# EasyEDA Pro project ProDoc_P1_2025-09-22.epro

# Schematic Schematic3
Board Name: 处理器; Create Date: 2024-10-04; Page Name: P1; Project Name: 八通道接口; Schematic Name: Schematic3; Update Date: 2024-10-06; Company: 嘉立创EDA; Page Size: B; Version: V1.0
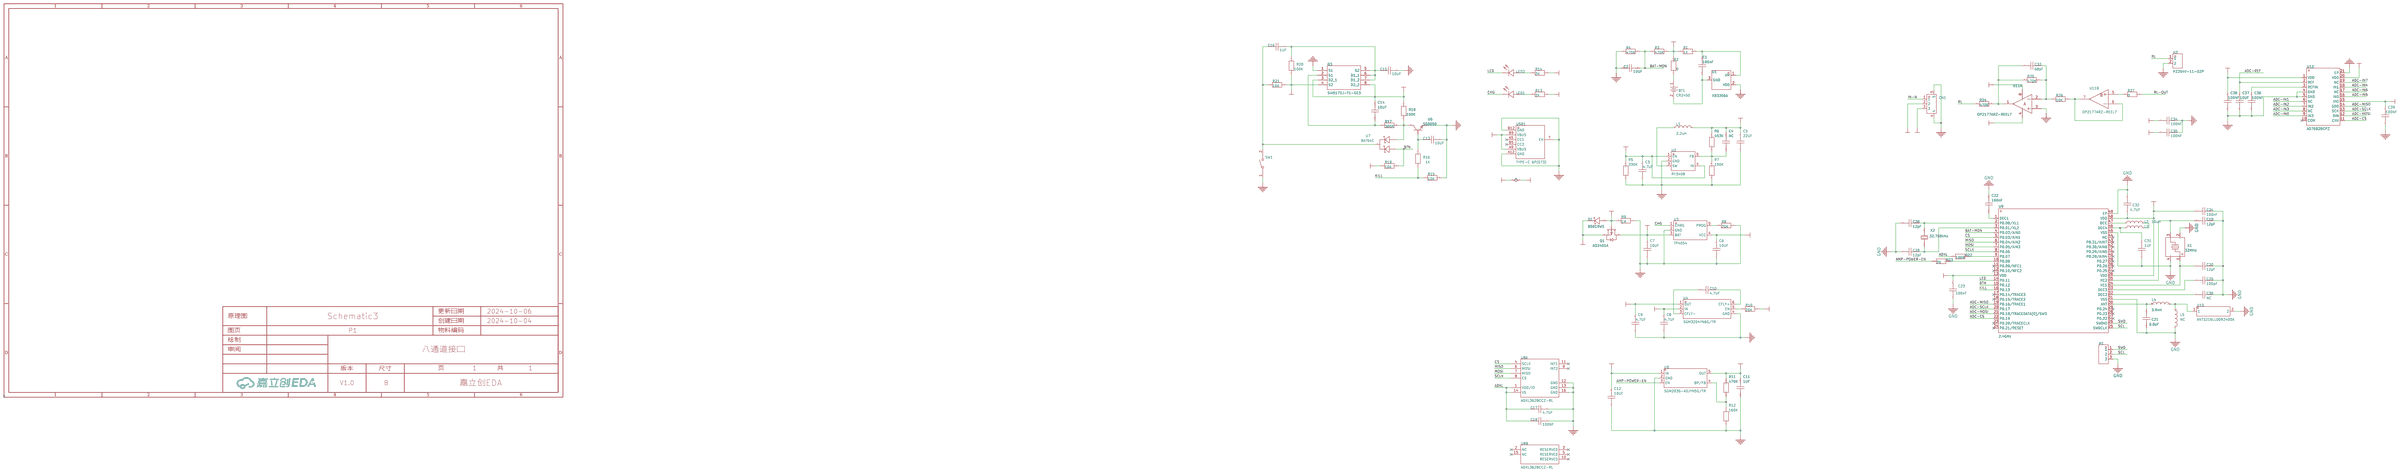
[diagram p0: schematic sheet]

## Parts
BT1  CR2450  [BAT-SMD_BS-24-B4AA016]
C1  100nF  [C0603]
C2  10UF  [C0603]
C3  4.7UF  [C0603]
C4  NC  [C0603]
C5  22UF  [C0603]
C6  10UF  [C0603]
C7  10UF  [C0603]
C8  4.7UF  [C0603]
C9  4.7UF  [C0603]
C10  4.7UF  [C0603]
C11  1UF  [C0603]
C12  10UF  [C0603]
C13  10UF  [C0603]
C14  10UF  [C0603]
C15  10UF  [C0603]
C16  1UF  [C0603]
C17  4.7UF  [C0603]
C18  100NF  [C0603]
C19  12pF  [C0603]
C20  12pF  [C0603]
C21  0.8pF  [C0603]
C22  100nF  [C0603]
C23  100nF  [C0603]
C24  100nF  [C0603]
C25  100pF  [C0603]
C28  12pF  [C0603]
C29  12pF  [C0603]
C30  NC  [C0603]
C31  1UF  [C0603]
C32  4.7UF  [C0603]
C33  68pF  [C0603]
C34  100NF  [C0603]
C35  100NF  [C0603]
C36  100NF  [C0603]
C37  10UF  [C0603]
C38  100NF  [C0603]
C39  100NF  [C0603]
CN1  WAFER-GH1.25-3PLB  [CONN-SMD_3P-P1.25_XUNPU_WAFER-GH1.25-3PLB]
D1  B5819WS  [SOD-323_L1.7-W1.3-LS2.5-FD]
H1  PZ254V-11-03P  [HDR-TH_3P-P2.54-V-M]
H2  PZ254V-11-02P  [HDR-TH_2P-P2.54-V-M]
L1  2.2uH  [IND-SMD_L3.0-W3.0_FNR30XXS]
L2  10uH  [L0603]
L3  -  [L0603]
L4  3.9nH  [L0603]
L5  NC  [L0603]
LED1  XL-1608UGC-04  [LED0603-RD_GREEN]
LED2  XL-1608UGC-04  [LED0603-RD_GREEN]
Q1  AO3401A  [SOT-23_L2.9-W1.3-P1.90-LS2.4-BR]
Q3  SIA517DJ-T1-GE3  [SIA537EDJT1GE3]
R1  1K  [R0603]
R2  0  [R0603]
R3  470K  [R0603]
R4  470K  [R0603]
R5  330K  [R0603]
R6  453K  [R0603]
R7  100K  [R0603]
R8  20K  [R0603]
R9  1M  [R0603]
R10  20K  [R0603]
R11  470K  [R0603]
R12  160K  [R0603]
R13  2K  [R0603]
R14  2K  [R0603]
R15  10K  [R0603]
R16  1K  [R0603]
R17  300K  [R0603]
R18  100K  [R0603]
R19  10K  [R0603]
R20  100K  [R0603]
R21  10K  [R0603]
R22  100R  [R0603]
R23  2K  [R0603]
R24  470K  [R0603]
R25  470K  [R0603]
R26  10K  [R0603]
R27  0  [R0603]
SW1  TS-1088-AR02016  [SW-SMD_L3.9-W3.0-P4.45]
U1  XB3306A  [SOT-23-3_L2.9-W1.3-P1.90-LS2.4-BR]
U2  RY3408  [SOT-23-5_L3.0-W1.7-P0.95-LS2.8-BL]
U3  TP4054  [TSOT-23-5_L2.9-W1.6-P0.95-LS2.8-BR]
U4  SGM3204YN6G/TR  [SOT-23-6_L2.9-W1.6-P0.95-LS2.8-BR]
U5  SGM2036-ADJYN5G/TR  [SOT-23-5_L3.0-W1.7-P0.95-LS2.8-BR]
U6  SS8050  [SOT-23-3_L2.9-W1.3-P1.90-LS2.4-BR]
U7  BAT54C  [SOT-23-3_L2.9-W1.3-P1.90-LS2.8-BR]
U8  ADXL362BCCZ-RL  [LGA-16_L3.0-W3.0-P0.50-BL]  (sections 1,2)
U9  2.4GHz  [QFN-48_L6.0-W6.0-P0.40-BL-EP3.8]
U10  ANT3216LL00R2400A  [ANT-SMD_L3.2-W1.6]
U11  OP2177ARZ-REEL7  [SOIC-8_L4.9-W3.9-P1.27-LS6.0-BL]  (sections 1,2)
U13  AD7682BCPZ  [LFCSP-20_L4.0-W4.0-P0.50-BL-EP]
USB1  TYPE-C 6P(073)  [type-c-smd_type-c-6p_5]
X1  32MHz  [OSC-SMD_4P-L2.5-W2.0-BL]
X2  32.768kHz  [FC-135R_L3.2-W1.5]

## Library data of the parts
BT1 = BS-24-B4AA016: 连接器类型:电池底座;适用电池规格:CR2450;触头材质:磷青铜;触点电镀:金;工作温度范围:-25℃~+85℃;; LCSC Part Name: 电池底座 适用电池:CR2450; Supplier Part: C964809; Manufacturer: MYOUNG(美阳); Supplier Footprint: SMD; JLCPCB Part Class: 扩展库; Datasheet: https://atta.szlcsc.com/upload/public/pdf/source/20201218/C964809_BD8C45521F70722290681D69F2DA628A.pdf; Supplier: LCSC; Connector Type: 电池底座; Contact Material: 磷青铜; Contact Plating: 金; Operating Temperature Range: -25℃~+85℃
C1-C18 = CGA0603X7R104K500JT: 容值:100nF;精度:±10%;额定电压:50V;材质(温度系数):X7R;; LCSC Part Name: 100nF ±10% 50V; Supplier Part: C6119867; Manufacturer: HRE(芯声); Supplier Footprint: 0603; JLCPCB Part Class: 扩展库; Supplier: LCSC; Tolerance: ±10%; Voltage Rated: 50V; Temperature Coefficient: X7R
C19 C20 C28 C29 C31 C33-C39 = CC0402GRNPO9BN120: 容值:12pF;精度:±2%;额定电压:50V;温度系数:NP0;; LCSC Part Name: 12pF ±2% 50V; Supplier Part: C526985; Manufacturer: YAGEO(国巨); Supplier Footprint: 0402; JLCPCB Part Class: Extended Part; Datasheet: https://atta.szlcsc.com/upload/public/pdf/source/20200508/C526985_2566F49E1D94CC0AC949362F5EB10F49.pdf; Supplier: LCSC; Tolerance: ±2%; Voltage Rated: 50V; Temperature Coefficient: NP0
C21 C32 = CQ0402ARNPO9BNR80: 容值:0.8pF;精度:±0.05pF;额定电压:50V;温度系数:NP0;; LCSC Part Name: 0.8pF ±0.05pF 50V; Supplier Part: C326068; Manufacturer: YAGEO(国巨); Supplier Footprint: 0402; JLCPCB Part Class: Extended Part; Datasheet: https://atta.szlcsc.com/upload/public/pdf/source/20181101/C326068_D0FC49304879CB601ADA20C4727E8D93.pdf; Supplier: LCSC; Tolerance: ±0.05pF; Voltage Rated: 50V; Temperature Coefficient: NP0
C22-C24 = C1005X7R104KETS: 容值:100nF;精度:±10%;额定电压:16V;温度系数:X7R;; LCSC Part Name: 100nF ±10% 16V; Supplier Part: C258508; Manufacturer: DARFON(达方); Supplier Footprint: 0402; JLCPCB Part Class: Extended Part; Datasheet: https://atta.szlcsc.com/upload/public/pdf/source/20180725/C258508_EA3BFA58F1A544422DA763431BB20E73.pdf; Supplier: LCSC; Tolerance: ±10%; Voltage Rated: 16V; Temperature Coefficient: X7R
C25 C30 = CQ0402JRNPO9BN101: 容值:100pF;精度:±5%;额定电压:50V;温度系数:NP0;; LCSC Part Name: 100pF ±5% 50V; Supplier Part: C326074; Manufacturer: YAGEO(国巨); Supplier Footprint: 0402; JLCPCB Part Class: Extended Part; Datasheet: https://atta.szlcsc.com/upload/public/pdf/source/20181101/C326074_48AA9354DCFD900F10620D275C89A19A.pdf; Supplier: LCSC; Tolerance: ±5%; Voltage Rated: 50V; Temperature Coefficient: NP0
CN1 = WAFER-GH1.25-3PLB: 插针结构:1x3P;间距:1.25mm;安装方式:立贴;参考系列:GH;总PIN数:3P;排数:1;每排PIN数:3;额定电流:1A;工作温度范围:-25℃~+85℃;; LCSC Part Name: 1x3P 间距:1.25mm 立贴 系列:GH; Supplier Part: C3029369; Manufacturer: XUNPU(讯普); Supplier Footprint: SMD,P=1.25mm; JLCPCB Part Class: 扩展库; Datasheet: https://atta.szlcsc.com/upload/public/pdf/source/20220527/44F824AAC8C2B617205E15955FF9C23D.pdf; Supplier: LCSC; Pins Structure: 1x3P; Pitch: 1.25mm; Mounting Style: 立贴; Reference Series: GH; Number of Pins: 3P; Number of Rows: 1; Number of PINs Per Row: 3; Current Rating (Max): 1A; Operating Temperature Range: -25℃~+85℃
D1 = B5819WS_C7420331: 二极管配置:独立式;正向压降(Vf):600mV@1.0A;直流反向耐压(Vr):40V;平均整流电流(Io):1A;; LCSC Part Name: 电压:40V 电流:1A; Supplier Part: C7420331; Manufacturer: 宏迦橙; Supplier Footprint: SOD-323; JLCPCB Part Class: 扩展库; Datasheet: https://atta.szlcsc.com/upload/public/pdf/source/20230828/03CA0F4F90DAE368A7153B7B5E4D0651.pdf; Supplier: LCSC; Diode Configuration: 独立式; Forward Voltage (Vf@If): 600mV@1.0A; Reverse Voltage (Vr): 40V; Average Rectified Current (Io): 1A; Reverse Leakage Current (Ir): 1mA@40V; Peak forward surge current: 10A
H1 = PZ254V-11-03P: 插针结构:1x3P;间距:2.54mm;行距:-;圆针/方针:方针;安装类型:直插;排数:单排;总PIN位数:3P;额定电流:3A;额定电压:250V;配合针长度:6mm;塑高:2.5mm;端接针长度:3mm;工作温度范围:-40℃~+105℃;颜色:黑色;; LCSC Part Name: 间距:2.54mm 1x3P 直插 方针; Supplier Part: C2937625; Manufacturer: XFCN(兴飞); Supplier Footprint: 插件,P=2.54mm; JLCPCB Part Class: Extended Part; Datasheet: https://atta.szlcsc.com/upload/public/pdf/source/20200309/C492402_8335C3D49C4E4C618838D59BB1D024C1.pdf; Supplier: LCSC; Pin Structure: 1x3P; Pitch: 2.54mm; Circluar Pins/Square Pins: 方针; Mounting Type: 直插; Number of Rows: 单排; Number of Pins: 3P; Current Rating (Max): 3A; Voltage Rating (Max): 250V; Length of Mating Pin: 6mm; Insulation Height: 2.5mm; Length of End Connection Pin: 3mm; Operating Temperature Range: -40℃~+105℃; Color: 黑色
H2 = PZ254V-11-02P: 插针结构:1x2P;间距:2.54mm;行距:-;圆针/方针:方针;安装类型:直插;排数:单排;总PIN位数:2P;额定电流:-;额定电压:-;配合针长度:6mm;塑高:2.5mm;端接针长度:3mm;触头材质:黄铜;触头镀层:-;工作温度范围:-40℃~+105℃;颜色:黑色;; LCSC Part Name: 间距:2.54mm 1x2P 直插 方针; Supplier Part: C492401; Manufacturer: XFCN(兴飞); Supplier Footprint: 插件,P=2.54mm; JLCPCB Part Class: 扩展库; Datasheet: https://atta.szlcsc.com/upload/public/pdf/source/20200309/C492401_A812433581A9B211A7FFA413ADDFF0E5.pdf; Supplier: LCSC; Pin Structure: 1x2P; Pitch: 2.54mm; Circluar Pins/Square Pins: 方针; Mounting Type: 直插; Number of Rows: 单排; Number of Pins: 2P; Length of Mating Pin: 6mm; Insulation Height: 2.5mm; Length of End Connection Pin: 3mm; Contact Material: 黄铜; Operating Temperature Range: -40℃~+105℃; Color: 黑色
L1 = FNR3015S2R2MT: 电感值:2.2uH;精度:±20%;额定电流:2A;饱和电流(Isat):2A;; LCSC Part Name: 2.2uH ±20% 2A; Supplier Part: C167747; Manufacturer: cjiang(长江微电); Supplier Footprint: SMD,3x3mm; JLCPCB Part Class: 扩展库; Datasheet: https://atta.szlcsc.com/upload/public/pdf/source/20190327/C167925_9EFF0AABC4CA629C2CC95961DBF7D39D.pdf; Supplier: LCSC; Tolerance: ±20%; Rated Current: 2A; Saturation Current (Isat): 2A; DC Resistance (DCR): 78mΩ
L2 = LQM18FN100M00D: 电感值:10uH;精度:±20%;额定电流:50mA;饱和电流(Isat):50mA;直流电阻(DCR):1.17Ω;; LCSC Part Name: 10uH ±20% 50mA 1.17Ω; Supplier Part: C86083; Manufacturer: muRata(村田); Supplier Footprint: 0603; JLCPCB Part Class: Extended Part; Datasheet: https://atta.szlcsc.com/upload/public/pdf/source/20180326/C86083_6DDCA9CD05C37F0AFED9B88B7434ACEF.pdf; Supplier: LCSC; Tolerance: ±20%; Rated Current: 50mA; Saturation Current (Isat): 50mA; DC Resistance (DCR): 1.17Ω; Frequency - Self Resonant: 1MHz
L3 = L-07C15NJV6T: LCSC Part Name: 15nH ±5%; Supplier Part: C2917773; Manufacturer: JOHANSON(约翰逊); Supplier Footprint: 0402; JLCPCB Part Class: Extended Part; Datasheet: https://atta.szlcsc.com/upload/public/pdf/source/20220331/C04B3CF5D6A84B7529F17B4246DB74C2.pdf; Supplier: LCSC
L4 L5 = SDCL1005C3N9CTDFM01: 电感值:3.9nH;精度:±0.2nH;额定电流:-;饱和电流(Isat):-;直流电阻(DCR):-;; LCSC Part Name: 3.9nH ±0.2nH; Supplier Part: C370222; Manufacturer: Sunlord(顺络); Supplier Footprint: 0402; JLCPCB Part Class: Extended Part; Datasheet: https://atta.szlcsc.com/upload/public/pdf/source/20210916/2389196E6DC4CA1121B2D3610B126F46.pdf; Supplier: LCSC; Tolerance: ±0.2nH
LED1 LED2 = XL-1608UGC-04: 灯头类型:-;发光颜色:翠绿色;正向电压(VF):-;功率:80mW;正向电流:25mA;主波长:516nm~525nm;二极管配置:独立二极管;透镜颜色:无色透明透镜;色温:-;发光强度:-;发光角度:120°;载带方式:正贴;工作温度:-30℃~+85℃;; Supplier Part: C965804; Manufacturer: XINGLIGHT(成兴光); Supplier Footprint: 0603; JLCPCB Part Class: 扩展库; Datasheet: https://atta.szlcsc.com/upload/public/pdf/source/20221102/520D6E465E5CFD1609C8A4DBC80D4018.pdf; Supplier: LCSC; Emitted Color: 翠绿色; Power Dissipation: 80mW; Forward Current: 25mA; Dominant Wavelength: 516nm~525nm; Peak Wavelength: 534nm; Diode Configuration: 独立二极管; Lens Color: 无色透明透镜; Viewing Angle: 120°; Mounting Sytle: 正贴; Operating Temperature: -30℃~+85℃
Q1 = AO3401A_C347476: 类型:1个P沟道;漏源电压(Vdss):30V;连续漏极电流(Id):4.2A;功率(Pd):1.4W;导通电阻(RDS(on)@Vgs,Id):50mΩ@4.2A,10V;阈值电压(Vgs(th)@Id):1.3V@250uA;; LCSC Part Name: 1个P沟道 耐压:30V 电流:4.2A; Supplier Part: C347476; Manufacturer: UMW(友台半导体); Supplier Footprint: SOT-23; JLCPCB Part Class: 扩展库; Datasheet: https://atta.szlcsc.com/upload/public/pdf/source/20231109/42F312EBB081D72F04A7E8221BFFAF9D.pdf; Supplier: LCSC; Type: 1个P沟道; Drain Source Voltage (Vdss): 30V; Continuous Drain Current (Id): 4.2A; Power Dissipation (Pd): 1.4W; Drain Source On Resistance (RDS(on)@Vgs,Id): 50mΩ@4.2A,10V; Gate Threshold Voltage (Vgs(th)@Id): 1.3V@250uA; Total Gate Charge (Qg@Vgs): 9.4nC@4.5V; Input Capacitance (Ciss@Vds): 954pF@15V
Q3 = SIA517DJ-T1-GE3: Pin Type: IN; Datasheet Link: http://www.vishay.com/docs/64832/sia517dj.pdf; Height: 0mm; Manufacturer_Name: Vishay; Mouser Part Number: 781-SIA517DJ-GE3; Mouser Price/Stock: https://www.mouser.co.uk/ProductDetail/Vishay-Semiconductors/SIA517DJ-T1-GE3?qs=45wPT2wjtGkShl%2FpUOiuDw%3D%3D; Arrow Price/Stock: https://www.arrow.com/en/products/sia517dj-t1-ge3/vishay?region=nac
R1-R27 = FRC0603J103TS: 电阻类型:厚膜电阻;阻值:10kΩ;精度:±5%;功率:100mW;最大工作电压:75V;温度系数:±100ppm/℃;; LCSC Part Name: 10kΩ ±5% 100mW 厚膜电阻; Supplier Part: C2930027; Manufacturer: FOJAN(富捷); Supplier Footprint: 0603; JLCPCB Part Class: 扩展库; Datasheet: https://atta.szlcsc.com/upload/public/pdf/source/20211221/925EC7D7225764EE0046F22065062C87.pdf; Supplier: LCSC; Type: 厚膜电阻; Tolerance: ±5%; Power(Watts): 100mW; Overload Voltage (Max): 75V; Temperature Coefficient: ±100ppm/℃; Operating Temperature Range: -55℃~+155℃
SW1 = TS-1088-AR02016: 电路结构:单刀单掷;按钮形状:圆形按钮;作用力:160gf;安装方式:立贴;开关长度:4mm;开关宽度:3mm;开关高度:2mm;带支架:不带;触点电流:50mA;额定电压(DC):12V;绝缘电阻:100MΩ;机械寿命:10万次;; LCSC Part Name: 4*3*2mm 立贴 轻触开关; Supplier Part: C720477; Manufacturer: XUNPU(讯普); Supplier Footprint: SMD; JLCPCB Part Class: 扩展库; Datasheet: https://atta.szlcsc.com/upload/public/pdf/source/20200810/C720475_60D09DD6C54279ADDB2DC25100F1CC11.pdf; Supplier: LCSC; Circuit: 单刀单掷; Actuator Style: 圆形按钮; Operating Force: 160gf; Mounting Style: 立贴; Switch Length: 4mm; Switch Width: 3mm; Switch Height: 2mm; Strike Gundam: 不带; Contact Current: 50mA; Voltage Rating (DC): 12V; Insulation Resistance: 100MΩ; Actuator/Cap Color: 黑色; Pin Style: SMD接片; Mechanical Life: 10万次; Operating Temperature: -30℃~+80℃
U1 = XB3306A: 锂电池保护; Supplier Part: C154939; Manufacturer: xysemi(赛芯微); Supplier Footprint: SOT-23; JLCPCB Part Class: 扩展库; Datasheet: https://atta.szlcsc.com/upload/public/pdf/source/20171201/C154939_15121109364511155496.pdf; Supplier: LCSC
U2 = RY3408: LCSC Part Name: RY3408 Buck, 2.5-5.5V, 1.0A, 1.5MHz, VFB 0.6V, SOT23-5; Supplier Part: C370750; Manufacturer: RYCHiP(蕊源); Supplier Footprint: SOT-23-5; JLCPCB Part Class: 扩展库; Datasheet: https://atta.szlcsc.com/upload/public/pdf/source/20190401/C370750_391097459A1376D00374F95CC0163C7D.pdf; Supplier: LCSC
U3 = TP4054_C668215: 电源电压:6.5V;最大充电电流:500mA;电池类型:锂离子/聚合物;电池节数:1;; Supplier Part: C668215; Manufacturer: UMW(友台半导体); Supplier Footprint: SOT-23-5L; JLCPCB Part Class: 扩展库; Datasheet: https://atta.szlcsc.com/upload/public/pdf/source/20231109/1E60770826C4E1A0E5898BBC08FF3A57.pdf; Supplier: LCSC; Supply Voltage: 6.5V; Maximum Charge Current: 500mA; Type of Battery: 锂离子/聚合物; Number of Cells: 1; Operating Temperature: -40℃~+85℃
U4 = SGM3204YN6G/TR: 电荷泵芯片，开关电容式电压变换器，最大输出200mA,可用于运放放大、滤波等电路; Supplier Part: C194031; Manufacturer: SGMICRO(圣邦微); Supplier Footprint: SOT-23-6; JLCPCB Part Class: 扩展库; Datasheet: https://atta.szlcsc.com/upload/public/pdf/source/20180627/C194031_755051E53122D645C36CF727711B963E.pdf; Supplier: LCSC
U5 = SGM2036-ADJYN5G/TR: 输出类型:-;; Supplier Part: C194594; Manufacturer: SGMICRO(圣邦微); Supplier Footprint: SOT-23-5; JLCPCB Part Class: 扩展库; Supplier: LCSC
U6 = SS8050_C7420370: 晶体管类型:NPN;集电极电流(Ic):1.5A;集射极击穿电压(Vceo):25V;功率(Pd):300mW;直流电流增益(hFE@Ic,Vce):120@100mA,1.0V;; LCSC Part Name: 耐压:25V 电流:1.5A NPN H档 200-350; Supplier Part: C7420370; Manufacturer: 宏迦橙; Supplier Footprint: SOT-23; JLCPCB Part Class: 扩展库; Datasheet: https://atta.szlcsc.com/upload/public/pdf/source/20231222/9C4050A7669EB24B3ACD0418218817FD.pdf; Supplier: LCSC; Transistor Type: NPN; Collector Current (Ic): 1.5A; Collector-Emitter Breakdown Voltage (Vceo): 25V; Power Dissipation (Pd): 300mW; DC Current Gain (hFE@Ic,Vce): 120@100mA,1.0V; Transition Frequency (fT): 100MHz; Collector Cut-Off Current (Icbo): 100nA; Collector-Emitter Saturation Voltage (VCE(sat)@Ic,Ib): 500mV@800mA,80mA; Operating Temperature: -55℃~+150℃
U7 = BAT54C_C22466350: 二极管配置:独立式;正向压降(Vf):1V@100mA;直流反向耐压(Vr):30V;整流电流:200mA;; LCSC Part Name: 电压:30V 电流:200mA; Supplier Part: C22466350; Manufacturer: 宏迦橙; Supplier Footprint: SOT-23; JLCPCB Part Class: 扩展库; Datasheet: https://atta.szlcsc.com/upload/public/pdf/source/20240614/7248299EDBC3D3459EBA927429B63F21.pdf; Supplier: LCSC; Diode Configuration: 独立式; Forward Voltage (Vf@If): 1V@100mA; Reverse Voltage (Vr): 30V; Rectified Current: 200mA; Reverse Leakage Current (Ir): 2uA@25V
U8 = ADXL362BCCZ-RL: 微功耗、3轴、±2g/±4g/±8g数字输出MEMS加速度计; LCSC Part Name: 微功耗、3轴、±2 g/±4 g/±8 g数字输出MEMS加速度计; Supplier Part: C59641; Manufacturer: ADI(亚德诺); Supplier Footprint: LGA-16(3x3.3); JLCPCB Part Class: 扩展库; Datasheet: https://atta.szlcsc.com/upload/public/pdf/source/20200305/C192252_5BD2EE35B9B852FE3AA009C3A4EF36CB.pdf; Supplier: LCSC
U9 = NRF52832-QFAA-R: 类型:TxRx + MCU;作业频率:2.4GHz;输出功率:4dBm;接口类型:I2C, SPI, UART;工作电压:1.7V ~ 3.6V;; LCSC Part Name: nRF52832-QFAA-R; Supplier Part: C77540; Manufacturer: NORDIC; Supplier Footprint: QFN-48_6x6x04P; JLCPCB Part Class: Extended Part; Datasheet: https://atta.szlcsc.com/upload/public/pdf/source/20191122/C77540_B22384C9419DF4416C7889F27174782C.pdf; Supplier: LCSC; Type: TxRx + MCU; RF Family/Standard: Bluetooth, General ISM > 1GHz; Protocol: ANT, Bluetooth v5; Modulation: GFSK; Data Rate (Max): 2Mbps; Power - Output: 4dBm; Sensitivity: -96dBm; Serial Interfaces: I2C, SPI, UART; Voltage - Supply: 1.7V ~ 3.6V
U10 = ANT3216LL00R2400A: 天线类型:芯片天线;中心频点:2.45GHz;带宽:160MHz;峰值增益:5.05dBi;极化方式:线性;功率容量:1W;驻波比:-;; LCSC Part Name: 无线组件陶瓷芯片天线; Supplier Part: C293767; Manufacturer: YAGEO(国巨); Supplier Footprint: 1206; JLCPCB Part Class: 扩展库; Datasheet: https://atta.szlcsc.com/upload/public/pdf/source/20181012/C293767_CDE82A2F74DC82A94DB708CB53B68F23.pdf; Supplier: LCSC; Antenna Type: 芯片天线; Central Frequency: 2.45GHz; Bandwidth: 160MHz; Peak Gain: 5.05dBi; Polarization Type: 线性; Impedance: 50Ω; Power capacity: 1W; Operating Temperature: -40℃~+105℃
U11 = OP2177ARZ-REEL7: 放大器数:双路;增益带宽积(GBP):1.3MHz;输入偏置电流(Ib):500pA;压摆率(SR):0.7V/us;带宽(-3db):-;; Supplier Part: C16418; Manufacturer: ADI(亚德诺); Supplier Footprint: SOIC-8; JLCPCB Part Class: Extended Part; Datasheet: https://atta.szlcsc.com/upload/public/pdf/source/20191127/C462165_19F318AB81E396C61DC2A8E1ED8F24DD.pdf; Supplier: LCSC; Number of Circuits: 双路; Gain Bandwidth Product(GBP): 1.3MHz; Current - Input Bias(Ib): 500pA; Slew Rate(SR): 0.7V/us; Output Current: 10mA; Supply Current: 400uA; Operating Temperature: -40℃~+125℃
U13 = AD7682BCPZ: 接口:SPI；DSP;电源电压:2.3V~5.5V;采样率:250kHz;分辨率:16位;; Supplier Part: C398823; Manufacturer: ADI(亚德诺); Supplier Footprint: LFCSP-20(4x4); JLCPCB Part Class: 扩展库; Datasheet: https://atta.szlcsc.com/upload/public/pdf/source/20200312/C495032_D19F447F3A195A57A2F561BFAE1FAF73.pdf; Supplier: LCSC; Interface: SPI；DSP; differential input: 是; number of channels: 4; Supply Voltage: 2.3V~5.5V; sampling frequency: 250kHz; resolution: 16位; Operating Temperature: -40℃~+85℃
USB1 = TYPE-C 6P(073): 连接器类型:Type-C;标准:USB 3.1;公母:母;安装方式:卧贴;触点数量:6P;端口数量:1;额定电流 - 电源:3A;工作温度范围:-25℃~+85℃;; LCSC Part Name: Type-C 母 卧贴; Supplier Part: C668623; Manufacturer: SHOU HAN(首韩); Supplier Footprint: SMD; JLCPCB Part Class: 扩展库; Datasheet: https://atta.szlcsc.com/upload/public/pdf/source/20200618/C668623_A4B260DED7AC1949BAC6AE39E9F4CD80.pdf; Supplier: LCSC; Connector Type: Type-C; Standard: USB 3.1; Gender: 母; Mounting Style: 卧贴; Number of Contacts: 6P; Number of Ports: 1; Current Rating - Power (Max): 3A; Operating Temperature Range: -25℃~+85℃; Rated Voltage (Max): 5V; Connect-Disconnect Life: 1万次; Core Colour: 黑色
X1 = X201632MKB4SI: 晶振类型:贴片无源晶振;频率:32MHz;频率公差:±10ppm;频率稳定度:±20ppm;负载电容:8pF;工作温度:-40~+85;; LCSC Part Name: 32MHz ±10ppm 8pF; Supplier Part: C718072; Manufacturer: YXC扬兴科技; Supplier Footprint: SMD2016-4P; JLCPCB Part Class: Extended Part; Datasheet: https://atta.szlcsc.com/upload/public/pdf/source/20210329/C108154_97241DDF47B5B71D7D93F8906D63DA2F.pdf; Supplier: LCSC; Crystal Type: 贴片无源晶振; Frequency Tolerance: ±10ppm; Frequency Stability: ±20ppm; Load Capacitance: 8pF; Operating Temperature: -40~+85
X2 = Q13FC1350000400: 晶振类型:贴片无源晶振;频率:32.768kHz;频率公差:±20ppm;频率稳定度:-;负载电容:12.5pF;等效串联电阻(ESR):70kΩ;工作温度:-40~+85;; LCSC Part Name: 32.768kHz ±20ppm 12.5pF; Supplier Part: C32346; Manufacturer: EPSON(爱普生); Supplier Footprint: SMD3215-2P; JLCPCB Part Class: Basic Part; Datasheet: https://atta.szlcsc.com/upload/public/pdf/source/20190108/C32346_746D6B07EAF90824457A96480007685F.pdf; Supplier: LCSC; Crystal Type: 贴片无源晶振; Frequency Tolerance: ±20ppm; Load Capacitance: 12.5pF; Equivalent Series Resistance (ESR): 70kΩ; Operating Temperature: -40~+85

## Nets
3.3V: C4.2 C5.2 C12.2 C23.2 C24.2 C32.1 C39.1 L1.2 R6.2 R14.1 R19.2 U5.1(IN) U9.13(VDD) U9.36(VDD) U9.48(VDD) U13.15(VIO)
3.7V: C7.2 Q1.3(D) R1.1 R2.2 R3.2 U3.3(BAT)
AVCC: C8.2 C11.2 C34.2 C38.1 CN1.2 R10.1 R11.2 U4.2(IN) U5.5(OUT) U11.4(V-) U13.1(VDD) U13.20(VDD)
AVEE: C9.2 C35.2 CN1.3 U4.1(OUT) U11.8(V+)
GND: C2.2 C3.1 C5.1 C6.1 C7.1 C8.1 C9.1 C11.1 C12.1 C13.1 C15.1 C17.1 C18.1 C19.2 C20.2 C21.1 C22.2 C23.1 C24.1 C25.1 C28.1 C29.1 C30.1 C31.1 C32.2 C34.1 C35.1 C36.2 C37.2 C38.2 C39.2 CN1.4 CN1.5 H1.3 H2.2 L5.2 Q3.1(S1) R4.1 R5.1 R7.1 R8.1 R9.1 R12.1 R15.1 SW1.1 U1.2(VDD) U2.2(GND) U3.2(GND) U4.4(GND) U5.2(GND) U6.2(E) U8.12(GND) U8.13(GND) U8.16(GND) U9.31(VSS) U9.45(VSS) U9.49(EP) U10.2 U11.3(+IN A) U13.4(GND) U13.5(GND) U13.21(EP) USB1.7(EH) USB1.A12(GND) USB1.B12(GND) X1.2(GND) X1.4(GND)
VCC: C3.2 C14.2 Q3.3(D2_1) Q3.8(D2_2) R5.2 R18.2 U2.1(EN) U2.4(IN)
VIN: D1.2(K) Q1.2(S) Q3.4(S2) R20.1 R21.1
ADC-CS: U9.22(P0.19) U13.11(CNV)
ADC-IN0: U13.9(IN3)
ADC-IN1: U13.6(NC)
ADC-IN2: U13.7(IN2)
ADC-IN3: U13.8(NC)
ADC-IN4: U13.18(IN1)
ADC-IN5: U13.16(IN0)
ADC-IN6: U13.17(NC)
ADC-IN7: U13.19(NC)
ADC-MISO: U9.19(P0.16/TRACE1) U13.14(SDO)
ADC-MOSI: U9.21(P0.18/TRACEDATA[0]/SWO) U13.12(DIN)
ADC-REF: C37.1 U13.2(REF)
ADC-SCLK: U9.20(P0.17) U13.13(SCK)
ADXL: C17.2 C18.2 R22.2 U8.1(VDD/IO) U8.14(VS)
AMP-POWER-EN: R23.2 U5.3(EN)
BAT-MON: C2.1 R3.1 R4.2 U9.4(P0.02/AIN0)
BTN: R19.1 U7.1(A) U9.15(P0.12)
CHG: LED1.1(K) U3.1(CHRG)
CS: U8.4(SCLK) U9.5(P0.03/AIN1)
IN-N: CN1.1
KILL: R15.2 R16.1 U9.16(P0.13)
LED: LED2.1(K) U9.14(P0.11)
MISO: U8.6(MOSI) U9.6(P0.04/AIN2)
MOSI: U8.7(MISO) U9.7(P0.05/AIN3)
RL: H2.1 R24.2
RL-OUT: R27.1
SCL: H1.2 U9.25(SWDCLK)
SCLK: U8.8(CS) U9.8(P0.06)
SWD: H1.1 U9.26(SWDIO)
VUSB-5V: C6.2 D1.1(A) Q1.1(G) R9.2 R13.1 U3.4(VCC) USB1.A9(VBUS) USB1.B9(VBUS)
Net-(BT1-1): BT1.1 R2.1
Net-(BT1-2): BT1.2 C1.1 U1.3(GND)
Net-(C1-2): C1.2 R1.2 U1.1(VM)
Net-(C4-1): C4.1 R6.1 R7.2 U2.5(FB)
Net-(C10-1): C10.1 U4.6(CFLY+)
Net-(C10-2): C10.2 U4.3(CFLY-)
Net-(C13-2): C13.2 R16.2 U6.1(B)
Net-(C14-1): C14.1 Q3.2(G1) R17.2
Net-(C15-2): C15.2 C16.1 Q3.5(G2) Q3.6(D1_1) Q3.7(D1_2) R20.2
Net-(C16-2): C16.2 R21.2 SW1.2 U7.3(K)
Net-(C19-1): C19.1 U9.35(XC2) X1.3
Net-(C20-1): C20.1 U9.34(XC1) X1.1
Net-(C21-2): C21.2 L4.1 U9.30(ANT)
Net-(C22-1): C22.1 U9.1(DEC1)
Net-(C25-2): C25.2 U9.33(DEC3)
Net-(C28-2): C28.2 U9.2(P0.00/XL1) X2.2
Net-(C29-2): C29.2 U9.3(P0.01/XL2) X2.1
Net-(C30-2): C30.2 U9.32(DEC2)
Net-(C31-2): C31.2 L3.1 U9.46(DEC4)
Net-(C33-1): C33.1 R24.1 R25.2 U11.1(OUT A)
Net-(C33-2): C33.2 R25.1 R26.2 U11.2(-IN A)
Net-(C36-1): C36.1 U13.3(REFIN)
Net-(L1-1): L1.1 U2.3(SW)
Net-(L2-1): L2.1 U9.47(DCC)
Net-(L2-2): L2.2 L3.2
Net-(L4-2): L4.2 L5.1 U10.1
Net-(LED1-2): LED1.2(A) R13.2
Net-(LED2-2): LED2.2(A) R14.2
Net-(R8-2): R8.2 U3.5(PROG)
Net-(R10-2): R10.2 U4.5(EN)
Net-(R11-1): R11.1 R12.2 U5.4(BP/FB)
Net-(R17-1): R17.1 R18.1 U6.3(C) U7.2(A)
Net-(R22-1): R22.1 U9.9(P0.07)
Net-(R23-1): R23.1 U9.10(P0.08)
Net-(R26-1): R26.1 U11.6(-IN B) U11.7(OUT B)
Net-(R27-2): R27.2 U11.5(+IN B)

Not connected (* = marked no-connect by the designer): U8 2(NC)* 3(RESERVED)* 5(RESERVED)* 9(INT2)* 10(RESERVED)* 11(INT1)* 15(NC)*; U9 11(P0.09/NFC1)* 12(P0.10/NFC2)* 17(P0.14/TRACE3)* 18(P0.15/TRACE2)* 23(P0.20/TRACECLK)* 24(P0.21/RESET)* 27(P0.22)* 28(P0.23)* 29(P0.24)* 37(P0.25)* 38(P0.26)* 39(P0.27)* 40(P0.28/AIN4)* 41(P0.29/AIN5)* 42(P0.30/AIN6)* 43(P0.31/AIN7)* 44(NC)*; U13 10(COM)*; USB1 A5(CC1)* B5(CC2)*
